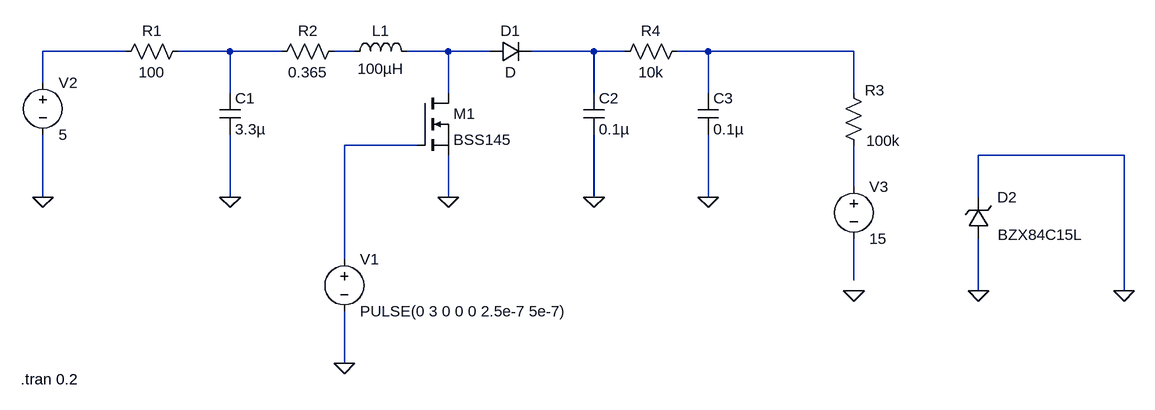
[diagram p0: schematic BoostPumpNPN.asc]
BoostPumpNPN.asc, the LTspice schematic file:
Version 4
SHEET 1 1460 680
WIRE -96 -80 -224 -80
WIRE 64 -80 -16 -80
WIRE 144 -80 64 -80
WIRE 256 -80 224 -80
WIRE 400 -80 336 -80
WIRE 464 -80 400 -80
WIRE 624 -80 528 -80
WIRE 672 -80 624 -80
WIRE 800 -80 752 -80
WIRE 1024 -80 800 -80
WIRE -224 -32 -224 -80
WIRE 64 -16 64 -80
WIRE 400 -16 400 -80
WIRE 624 -16 624 -80
WIRE 800 -16 800 -80
WIRE 1024 -16 1024 -80
WIRE 352 64 240 64
WIRE 1440 80 1216 80
WIRE 1024 128 1024 64
WIRE -224 144 -224 48
WIRE 64 144 64 48
WIRE 400 144 400 80
WIRE 624 144 624 48
WIRE 800 144 800 48
WIRE 1216 144 1216 80
WIRE 240 240 240 64
WIRE 1024 272 1024 208
WIRE 1216 288 1216 208
WIRE 1440 288 1440 80
WIRE 240 400 240 320
FLAG 64 144 0
FLAG 400 144 0
FLAG 624 144 0
FLAG 1216 288 0
FLAG 240 400 0
FLAG -224 144 0
FLAG 800 144 0
FLAG 1024 288 0
FLAG 1440 288 0
SYMBOL res 0 -96 R90
WINDOW 0 0 56 VBottom 2
WINDOW 3 32 56 VTop 2
SYMATTR InstName R1
SYMATTR Value 100
SYMBOL res 240 -96 R90
WINDOW 0 0 56 VBottom 2
WINDOW 3 32 56 VTop 2
SYMATTR InstName R2
SYMATTR Value 0.365
SYMBOL res 1040 80 R180
WINDOW 0 -32 100 Left 2
WINDOW 3 -56 23 Left 2
SYMATTR InstName R3
SYMATTR Value 100k
SYMBOL cap 48 -16 R0
SYMATTR InstName C1
SYMATTR Value 3.3µ
SYMBOL cap 608 -16 R0
SYMATTR InstName C2
SYMATTR Value 0.1µ
SYMBOL ind 240 -64 R270
WINDOW 0 32 56 VTop 2
WINDOW 3 5 56 VBottom 2
SYMATTR InstName L1
SYMATTR Value 100µH
SYMBOL diode 464 -64 R270
WINDOW 0 32 32 VTop 2
WINDOW 3 0 32 VBottom 2
SYMATTR InstName D1
SYMBOL nmos 352 -16 R0
SYMATTR InstName M1
SYMATTR Value BSS145
SYMBOL voltage 240 224 R0
WINDOW 123 0 0 Left 0
WINDOW 39 0 0 Left 0
SYMATTR InstName V1
SYMATTR Value PULSE(0 3 0 0 0 2.5e-7 5e-7)
SYMBOL voltage -224 -48 R0
WINDOW 123 0 0 Left 0
WINDOW 39 0 0 Left 0
SYMATTR InstName V2
SYMATTR Value 5
SYMBOL zener 1232 208 R180
WINDOW 0 -44 64 Left 2
WINDOW 3 -145 6 Left 2
SYMATTR InstName D2
SYMATTR Value BZX84C15L
SYMBOL res 768 -96 R90
WINDOW 0 0 56 VBottom 2
WINDOW 3 32 56 VTop 2
SYMATTR InstName R4
SYMATTR Value 10k
SYMBOL cap 784 -16 R0
SYMATTR InstName C3
SYMATTR Value 0.1µ
SYMBOL voltage 1024 112 R0
WINDOW 123 0 0 Left 0
WINDOW 39 0 0 Left 0
SYMATTR InstName V3
SYMATTR Value 15
TEXT -258 424 Left 2 !.tran 0.2

The netlist it stands for:
* BoostPumpNPN.asc
R1 N002 N001 100
R2 N003 N002 0.365
R3 N008 N006 100k
C1 N002 0 3.3µ
C2 N005 0 0.1µ
L1 N003 N004 100µH
D1 N004 N005 D
M1 N004 N007 0 0 BSS145
V1 N007 0 PULSE(0 3 0 0 0 2.5e-7 5e-7)
V2 N001 0 5
D2 0 0 BZX84C15L
R4 N006 N005 10k
C3 N006 0 0.1µ
V3 N008 N009 15
.model D D
.lib standard.dio
.model NMOS NMOS
.model PMOS PMOS
.lib standard.mos
.tran 0.2
.backanno
.end